# Altium schematic sheet LEDS & BUTTONS w bar.SchDoc
size 381 x 241 mm
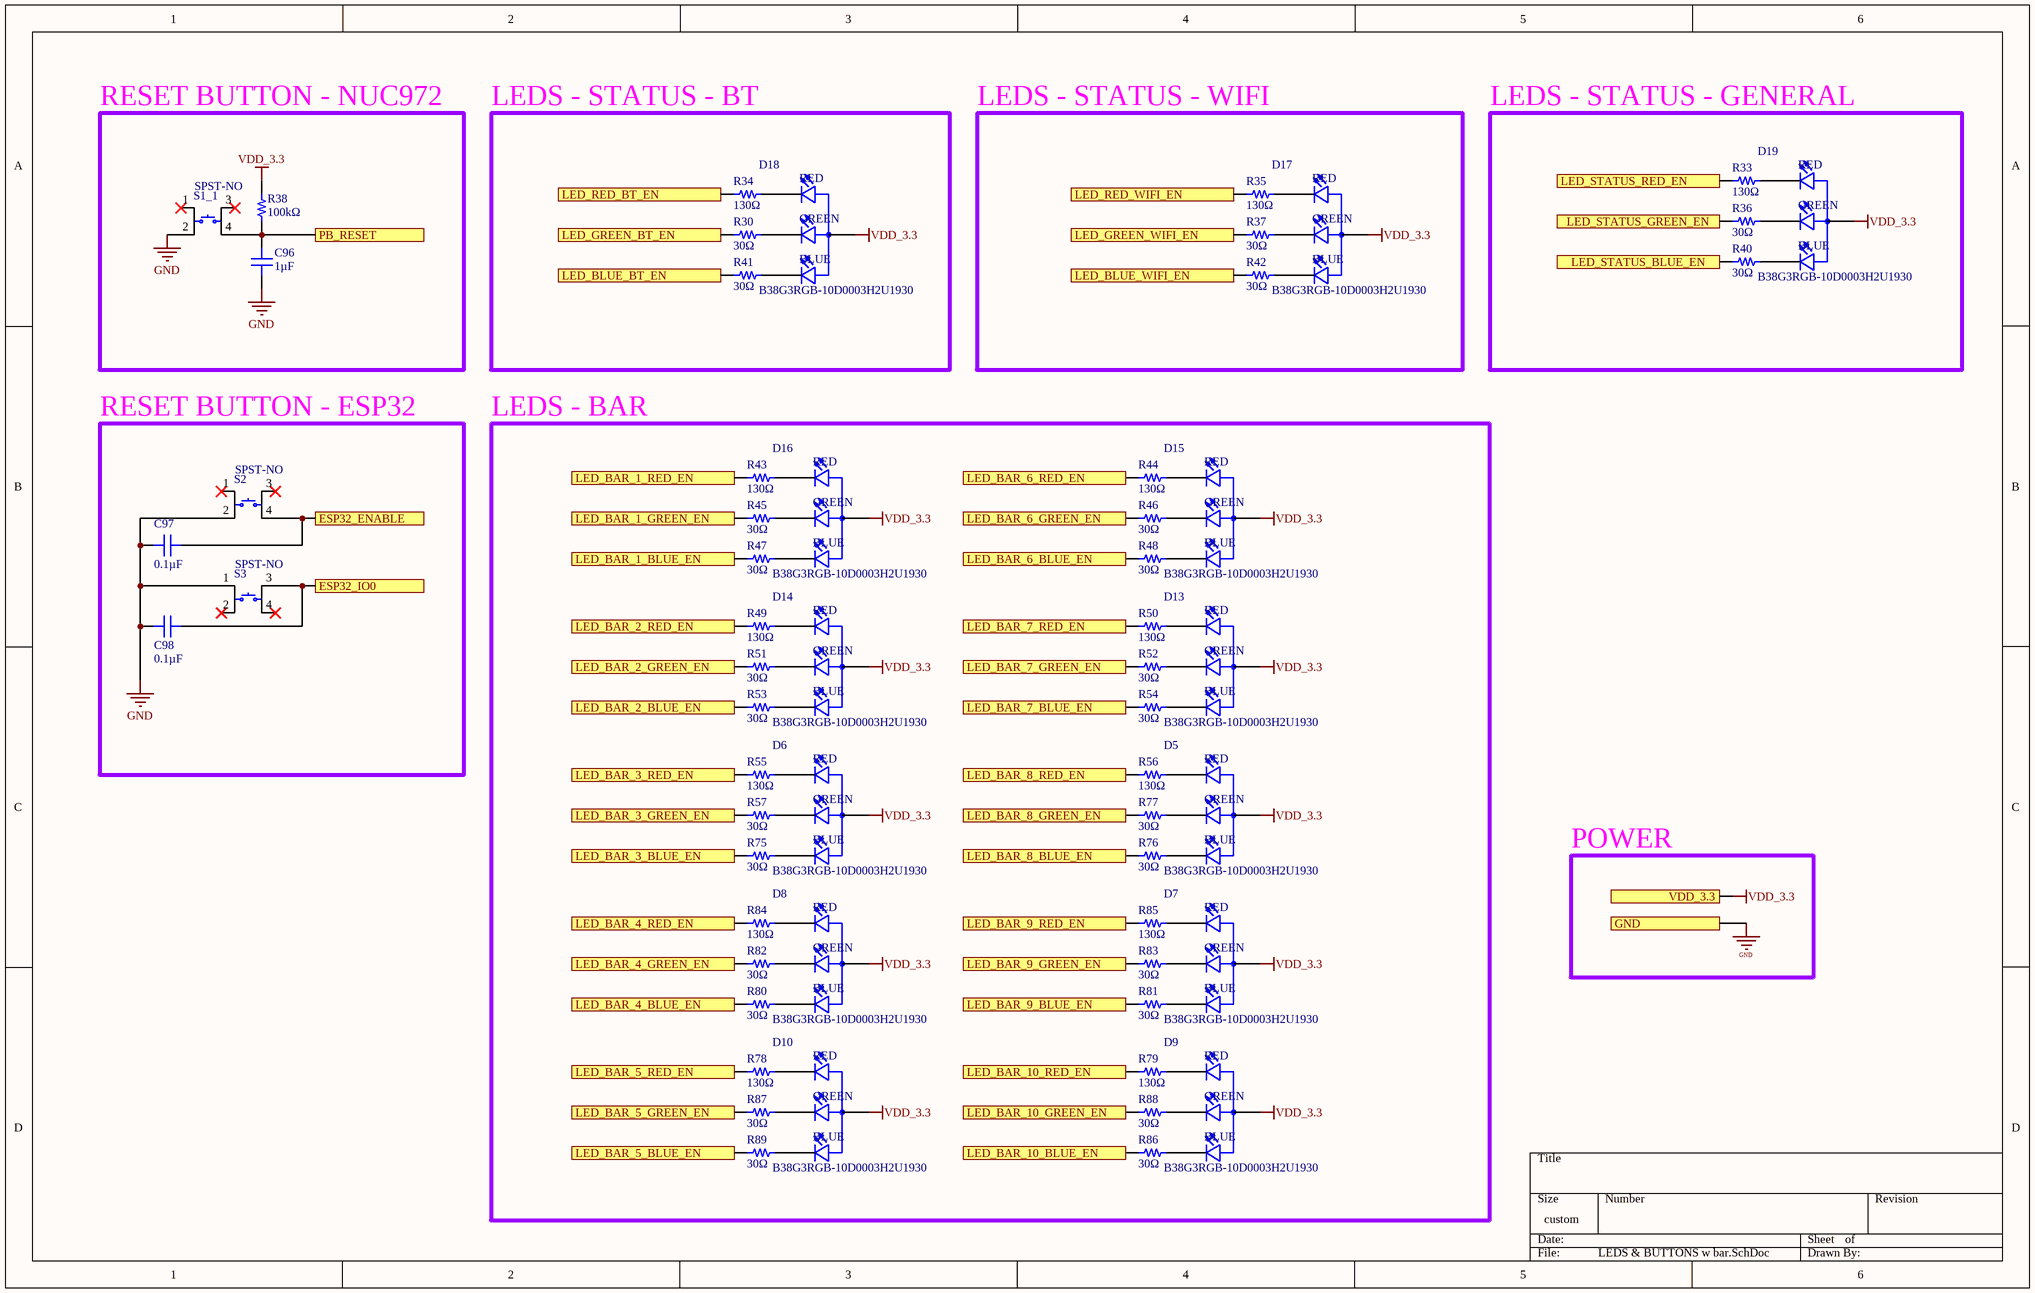
[diagram p0: LEDS & BUTTONS w bar.SchDoc]

## Parts
C96  1µF  [CAP 0603_1608]
C97  0.1µF  [CAP 0603_1608 RF]
C98  0.1µF  [CAP 0603_1608 RF]
D5  B38G3RGB-10D0003H2U1930  [LED_B38G3RGB-10D0003H2U1930]
D6  B38G3RGB-10D0003H2U1930  [LED_B38G3RGB-10D0003H2U1930]
D7  B38G3RGB-10D0003H2U1930  [LED_B38G3RGB-10D0003H2U1930]
D8  B38G3RGB-10D0003H2U1930  [LED_B38G3RGB-10D0003H2U1930]
D9  B38G3RGB-10D0003H2U1930  [LED_B38G3RGB-10D0003H2U1930]
D10  B38G3RGB-10D0003H2U1930  [LED_B38G3RGB-10D0003H2U1930]
D13  B38G3RGB-10D0003H2U1930  [LED_B38G3RGB-10D0003H2U1930]
D14  B38G3RGB-10D0003H2U1930  [LED_B38G3RGB-10D0003H2U1930]
D15  B38G3RGB-10D0003H2U1930  [LED_B38G3RGB-10D0003H2U1930]
D16  B38G3RGB-10D0003H2U1930  [LED_B38G3RGB-10D0003H2U1930]
D17  B38G3RGB-10D0003H2U1930  [LED_B38G3RGB-10D0003H2U1930]
D18  B38G3RGB-10D0003H2U1930  [LED_B38G3RGB-10D0003H2U1930]
D19  B38G3RGB-10D0003H2U1930  [LED_B38G3RGB-10D0003H2U1930]
R30  30Ω  [RES 0603_1608 RF]
R33  130Ω  [RES 0603_1608 RF]
R34  130Ω  [RES 0603_1608 RF]
R35  130Ω  [RES 0603_1608 RF]
R36  30Ω  [RES 0603_1608 RF]
R37  30Ω  [RES 0603_1608 RF]
R38  100kΩ  [RES 0402_1005 RF]
R40  30Ω  [RES 0603_1608 RF]
R41  30Ω  [RES 0603_1608 RF]
R42  30Ω  [RES 0603_1608 RF]
R43  130Ω  [RES 0603_1608 RF]
R44  130Ω  [RES 0603_1608 RF]
R45  30Ω  [RES 0603_1608 RF]
R46  30Ω  [RES 0603_1608 RF]
R47  30Ω  [RES 0603_1608 RF]
R48  30Ω  [RES 0603_1608 RF]
R49  130Ω  [RES 0603_1608 RF]
R50  130Ω  [RES 0603_1608 RF]
R51  30Ω  [RES 0603_1608 RF]
R52  30Ω  [RES 0603_1608 RF]
R53  30Ω  [RES 0603_1608 RF]
R54  30Ω  [RES 0603_1608 RF]
R55  130Ω  [RES 0603_1608 RF]
R56  130Ω  [RES 0603_1608 RF]
R57  30Ω  [RES 0603_1608 RF]
R75  30Ω  [RES 0603_1608 RF]
R76  30Ω  [RES 0603_1608 RF]
R77  30Ω  [RES 0603_1608 RF]
R78  130Ω  [RES 0603_1608 RF]
R79  130Ω  [RES 0603_1608 RF]
R80  30Ω  [RES 0603_1608 RF]
R81  30Ω  [RES 0603_1608 RF]
R82  30Ω  [RES 0603_1608 RF]
R83  30Ω  [RES 0603_1608 RF]
R84  130Ω  [RES 0603_1608 RF]
R85  130Ω  [RES 0603_1608 RF]
R86  30Ω  [RES 0603_1608 RF]
R87  30Ω  [RES 0603_1608 RF]
R88  30Ω  [RES 0603_1608 RF]
R89  30Ω  [RES 0603_1608 RF]
S1_1  SPST-NO  [TE FSM4JSMA]
S2  SPST-NO  [TE FSM4JSMA]
S3  SPST-NO  [TE FSM4JSMA]

## Blocks framed on the sheet
RESET BUTTON - NUC972: C96 R38 S1_1
LEDS - STATUS - BT: D18 R30 R34 R41
LEDS - STATUS - WIFI: D17 R35 R37 R42
LEDS - STATUS - GENERAL: D19 R33 R36 R40
RESET BUTTON - ESP32: C97 C98 S2 S3
LEDS - BAR: D5-D10 D13-D16 R43-R57 R75-R89

## Ports
ESP32_ENABLE, ESP32_IO0, GND, LED_BAR_1_BLUE_EN, LED_BAR_1_GREEN_EN, LED_BAR_1_RED_EN, LED_BAR_2_BLUE_EN, LED_BAR_2_GREEN_EN, LED_BAR_2_RED_EN, LED_BAR_3_BLUE_EN, LED_BAR_3_GREEN_EN, LED_BAR_3_RED_EN, LED_BAR_4_BLUE_EN, LED_BAR_4_GREEN_EN, LED_BAR_4_RED_EN, LED_BAR_5_BLUE_EN, LED_BAR_5_GREEN_EN, LED_BAR_5_RED_EN, LED_BAR_6_BLUE_EN, LED_BAR_6_GREEN_EN, LED_BAR_6_RED_EN, LED_BAR_7_BLUE_EN, LED_BAR_7_GREEN_EN, LED_BAR_7_RED_EN, LED_BAR_8_BLUE_EN, LED_BAR_8_GREEN_EN, LED_BAR_8_RED_EN, LED_BAR_9_BLUE_EN, LED_BAR_9_GREEN_EN, LED_BAR_9_RED_EN, LED_BAR_10_BLUE_EN, LED_BAR_10_GREEN_EN, LED_BAR_10_RED_EN, LED_BLUE_BT_EN, LED_BLUE_WIFI_EN, LED_GREEN_BT_EN, LED_GREEN_WIFI_EN, LED_RED_BT_EN, LED_RED_WIFI_EN, LED_STATUS_BLUE_EN, LED_STATUS_GREEN_EN, LED_STATUS_RED_EN, PB_RESET, VDD_3.3

## Nets
GND: C96.1 C97.2 C98.2 S1_1.2 S2.2 S3.1 ; port GND
VDD_3.3: D5.3(A) D6.3(A) D7.3(A) D8.3(A) D9.3(A) D10.3(A) D13.3(A) D14.3(A) D15.3(A) D16.3(A) D17.3(A) D18.3(A) D19.3(A) R38.2 ; port VDD_3.3
ESP32_ENABLE: C97.1 S2.4 ; port ESP32_ENABLE
ESP32_IO0: C98.1 S3.3 ; port ESP32_IO0
LED_BAR_1_BLUE_EN: R47.1 ; port LED_BAR_1_BLUE_EN
LED_BAR_1_GREEN_EN: R45.1 ; port LED_BAR_1_GREEN_EN
LED_BAR_1_RED_EN: R43.1 ; port LED_BAR_1_RED_EN
LED_BAR_2_BLUE_EN: R53.1 ; port LED_BAR_2_BLUE_EN
LED_BAR_2_GREEN_EN: R51.1 ; port LED_BAR_2_GREEN_EN
LED_BAR_2_RED_EN: R49.1 ; port LED_BAR_2_RED_EN
LED_BAR_3_BLUE_EN: R75.1 ; port LED_BAR_3_BLUE_EN
LED_BAR_3_GREEN_EN: R57.1 ; port LED_BAR_3_GREEN_EN
LED_BAR_3_RED_EN: R55.1 ; port LED_BAR_3_RED_EN
LED_BAR_4_BLUE_EN: R80.1 ; port LED_BAR_4_BLUE_EN
LED_BAR_4_GREEN_EN: R82.1 ; port LED_BAR_4_GREEN_EN
LED_BAR_4_RED_EN: R84.1 ; port LED_BAR_4_RED_EN
LED_BAR_5_BLUE_EN: R89.1 ; port LED_BAR_5_BLUE_EN
LED_BAR_5_GREEN_EN: R87.1 ; port LED_BAR_5_GREEN_EN
LED_BAR_5_RED_EN: R78.1 ; port LED_BAR_5_RED_EN
LED_BAR_6_BLUE_EN: R48.1 ; port LED_BAR_6_BLUE_EN
LED_BAR_6_GREEN_EN: R46.1 ; port LED_BAR_6_GREEN_EN
LED_BAR_6_RED_EN: R44.1 ; port LED_BAR_6_RED_EN
LED_BAR_7_BLUE_EN: R54.1 ; port LED_BAR_7_BLUE_EN
LED_BAR_7_GREEN_EN: R52.1 ; port LED_BAR_7_GREEN_EN
LED_BAR_7_RED_EN: R50.1 ; port LED_BAR_7_RED_EN
LED_BAR_8_BLUE_EN: R76.1 ; port LED_BAR_8_BLUE_EN
LED_BAR_8_GREEN_EN: R77.1 ; port LED_BAR_8_GREEN_EN
LED_BAR_8_RED_EN: R56.1 ; port LED_BAR_8_RED_EN
LED_BAR_9_BLUE_EN: R81.1 ; port LED_BAR_9_BLUE_EN
LED_BAR_9_GREEN_EN: R83.1 ; port LED_BAR_9_GREEN_EN
LED_BAR_9_RED_EN: R85.1 ; port LED_BAR_9_RED_EN
LED_BAR_10_BLUE_EN: R86.1 ; port LED_BAR_10_BLUE_EN
LED_BAR_10_GREEN_EN: R88.1 ; port LED_BAR_10_GREEN_EN
LED_BAR_10_RED_EN: R79.1 ; port LED_BAR_10_RED_EN
LED_BLUE_BT_EN: R41.1 ; port LED_BLUE_BT_EN
LED_BLUE_WIFI_EN: R42.1 ; port LED_BLUE_WIFI_EN
LED_GREEN_BT_EN: R30.1 ; port LED_GREEN_BT_EN
LED_GREEN_WIFI_EN: R37.1 ; port LED_GREEN_WIFI_EN
LED_RED_BT_EN: R34.1 ; port LED_RED_BT_EN
LED_RED_WIFI_EN: R35.1 ; port LED_RED_WIFI_EN
LED_STATUS_BLUE_EN: R40.1 ; port LED_STATUS_BLUE_EN
LED_STATUS_GREEN_EN: R36.1 ; port LED_STATUS_GREEN_EN
LED_STATUS_RED_EN: R33.1 ; port LED_STATUS_RED_EN
PB_RESET: C96.2 R38.1 S1_1.4 ; port PB_RESET
NetD5_1: D5.1(G_C) R77.2
NetD5_2: D5.2(B_C) R76.2
NetD5_4: D5.4(R_C) R56.2
NetD6_1: D6.1(G_C) R57.2
NetD6_2: D6.2(B_C) R75.2
NetD6_4: D6.4(R_C) R55.2
NetD7_1: D7.1(G_C) R83.2
NetD7_2: D7.2(B_C) R81.2
NetD7_4: D7.4(R_C) R85.2
NetD8_1: D8.1(G_C) R82.2
NetD8_2: D8.2(B_C) R80.2
NetD8_4: D8.4(R_C) R84.2
NetD9_1: D9.1(G_C) R88.2
NetD9_2: D9.2(B_C) R86.2
NetD9_4: D9.4(R_C) R79.2
NetD10_1: D10.1(G_C) R87.2
NetD10_2: D10.2(B_C) R89.2
NetD10_4: D10.4(R_C) R78.2
NetD13_1: D13.1(G_C) R52.2
NetD13_2: D13.2(B_C) R54.2
NetD13_4: D13.4(R_C) R50.2
NetD14_1: D14.1(G_C) R51.2
NetD14_2: D14.2(B_C) R53.2
NetD14_4: D14.4(R_C) R49.2
NetD15_1: D15.1(G_C) R46.2
NetD15_2: D15.2(B_C) R48.2
NetD15_4: D15.4(R_C) R44.2
NetD16_1: D16.1(G_C) R45.2
NetD16_2: D16.2(B_C) R47.2
NetD16_4: D16.4(R_C) R43.2
NetD17_1: D17.1(G_C) R37.2
NetD17_2: D17.2(B_C) R42.2
NetD17_4: D17.4(R_C) R35.2
NetD18_1: D18.1(G_C) R30.2
NetD18_2: D18.2(B_C) R41.2
NetD18_4: D18.4(R_C) R34.2
NetD19_1: D19.1(G_C) R36.2
NetD19_2: D19.2(B_C) R40.2
NetD19_4: D19.4(R_C) R33.2

Not connected (* = marked no-connect by the designer): S1_1 1* 3*; S2 1* 3*; S3 2* 4*

## Notes on the sheet
- POWER
- (in symbol B38G3RGB-10D0003H2U1930) RED; GREEN; BLUE

## Library data of the parts
C96 = CAP00007: CAP CER 1UF 10V X7R 0603; Manufacturer: KEMET; Manufacturer P/N: C0603C105K8RACTU; Tolerance: ±10%; Device ID: CAP00007; Mounting Type: Surface Mount; Part Type: Capacitor; VALUE: 1µF; Operating Temperature: -55°C ~ 125°C; Voltage: 10V; Package: 0603 (1608 Metric); Supplier1: Digi-Key; Supplier1 P/N: 399-11133-1-ND; Supplier2: Mouser; Supplier2 P/N: 80-C0603C105K8R; Temperature Coefficient: X7R
C97 C98 = CAP00039: CAP CER 0.1UF 16V X7R 0603; Manufacturer: KEMET; Manufacturer P/N: C0603C104M4RACAUTO; Tolerance: ±20%; Device ID: CAP00039; Mounting Type: Surface Mount; Part Type: Capacitor; VALUE: 0.1µF; Operating Temperature: -55°C ~ 125°C; Voltage: 16V; Package: 0603 (1608 Metric); Supplier1: Digi-Key; Supplier1 P/N: 399-C0603C104M4RACAUTOCT-ND; Supplier2: Mouser; Supplier2 P/N: C0603C104M4RACAUTO; Temperature Coefficient: X7R
D5-D10 D13-D19 = B38G3RGB-10D0003H2U1930: Red, Green, Blue (RGB) - LED Indication - Discrete 2V Red, 3V Green, 3V Blue 0606 (1616 Metric); MF: Harvatek Corporation; Price: None; Purchase-URL: https://pricing.snapeda.com/search/part/B38G3RGB-10D0003H2U1930/?ref=eda; SnapEDA_Link: https://www.snapeda.com/parts/B38G3RGB-10D0003H2U1930/Harvatek/view-part/?ref=snap; Availability: In Stock; Value: *; MP: B38G3RGB-10D0003H2U1930; Package: None; Check_prices: https://www.snapeda.com/parts/B38G3RGB-10D0003H2U1930/Harvatek/view-part/?ref=eda
R30 R36 R37 R40-R42 R45-R48 R51-R54 R57 R75-R77 R80-R83 R86-R89 = RES00039: RES 30 OHM 1% 1/10W 0603; Manufacturer: Vishay Dale; Manufacturer P/N: ‎CRCW0603820KFKEAC‎; Power: 0.100W; Device ID: RES00039; VALUE: 30Ω; Mounting Type: Surface Mount; Part Type: Resistor; Operating Temperature: -55°C ~ 155°C; Package: 0603 (1608 Metric); Tolerance: ±1%; Composition: Thick Film; Supplier1: Digi-Key; Supplier1 P/N: ‎541-5568-1-ND‎; Supplier2: Mouser; Supplier2 P/N: 71-CRCW0603820KFKEAC
R33-R35 R43 R44 R49 R50 R55 R56 R78 R79 R84 R85 = RES00038: RES 130 OHM 1% 1/10W 0603; Manufacturer: Vishay Dale; Manufacturer P/N: ‎CRCW0603820KFKEAC‎; Power: 0.100W; Device ID: RES00038; VALUE: 130Ω; Mounting Type: Surface Mount; Part Type: Resistor; Operating Temperature: -55°C ~ 155°C; Package: 0603 (1608 Metric); Tolerance: ±1%; Composition: Thick Film; Supplier1: Digi-Key; Supplier1 P/N: ‎541-5568-1-ND‎; Supplier2: Mouser; Supplier2 P/N: 71-CRCW0603820KFKEAC
R38 = RES0001D: RES SMD 100K OHM 1% 1/16W 0402; Manufacturer: Vishay Dale; Manufacturer P/N: RCG0402100KFKED; Power: 0.063W; Device ID: RES0001D; VALUE: 100kΩ; Mounting Type: Surface Mount; Part Type: Resistor; Operating Temperature: -55°C ~ 155°C; Package: 0402 (1005 Metric); Tolerance: ±1%; Composition: Thick Film; Supplier1: Digi-Key; Supplier1 P/N: 541-1751-1-ND; Supplier2: Mouser; Supplier2 P/N: 71-RCG0402100KFKED
S1_1 S2 S3 = GPTS202312B: SWITCH TACTILE SPST-NO 0.05A 24V; Manufacturer: TE Connectivity ALCOSWITCH Switches; Manufacturer P/N: FSM4JSMASTR; Switch Function: Off-Mom; Contact Rating @ Voltage: 0.05A @ 24VDC; Operating Force: 160gf; Device ID: GPTS202312B; Part Type: Button; VALUE: SPST-NO; Operating Temperature: -40°C ~ 105°C; Package: 4-Lead SMT; Supplier1: Digi-Key; Supplier1 P/N: 450-2141-1-ND; Supplier2: Mouser; Supplier2 P/N: 506-1-1977223-0; Mounting Type: Surface Mount